# Altium schematic sheet thermistor.SchDoc: thermistor
size A4; Organization: Badgerloop Electrical; Address1: 133 Engineering Research Building; Address2: 1500 Engineering Drive; Address3: Madison, Wi 53706
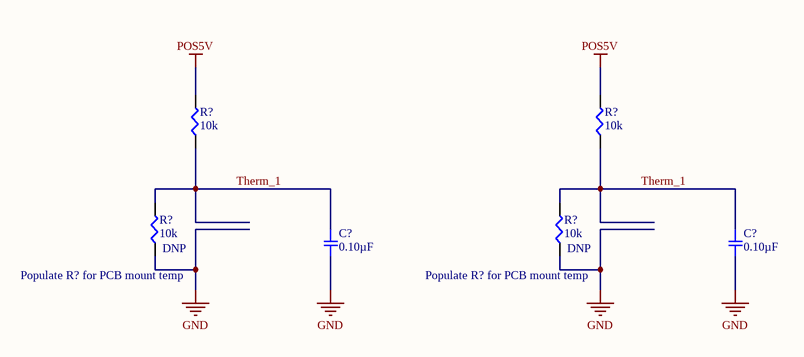
[diagram p0: thermistor.SchDoc]

## Parts
(Parts that share a designator on the sheet are numbered #1, #2 ... from top to bottom, then left to right.)
C?#1  0.10µF  [SMD-0805C]
C?#2  0.10µF  [SMD-0805C]
R?#1  10k  [SMD-0805-RES]
R?#2  10k  [SMD-0805-RES]
R?#3  10k  [SMD-0805-RES]
R?#4  10k  [SMD-0805-RES]

## Nets
GND: C?#1.2 C?#2.2 R?#3.1 R?#4.1
POS5V: R?#1.2 R?#2.2
Therm_1: C?#1.1 C?#2.1 R?#1.1 R?#2.1 R?#3.2 R?#4.2

## Notes on the sheet
- (near R?#3) Populate R? for PCB mount temp
- (near R?#4) Populate R? for PCB mount temp
- Title
- Engineer:
- Date:
- Time:
- Revision:
- Sheet
- of
- File:

## Library data of the parts
C?#1 C?#2 = GRM219R71C104KA01D: CAP CER 0.1UF 16V X7R 0805; Manufacturer: Murata Electronics North America; Factory Stock: 0; Unit Price (USD): 0.13; Minimum Quantity: 1; Tolerance: ±10%; Datasheets: http://www.murata.com/~/media/webrenewal/support/library/catalog/products/capacitor/mlcc/c02e.pdf; Image: //media.digikey.com/Renders/Murata%20Renders/0805%20(2012%20Metric)%20.85mm.jpg; Digi-Key Part Number: 490-1683-1-ND; Part Number: GRM219R71C104KA01D; Quantity Available: 265464; @ qty: 0; Packaging: Cut Tape (CT); Series: GRM; Part Status: Active; Value: 0.10µF; Voltage: 16V; Temperature Coefficient: X7R; Operating Temperature: -55°C ~ 125°C; Features: -; Ratings: -; Applications: General Purpose; Mounting Type: Surface Mount, MLCC; Package / Case: 0805 (2012 Metric); Size / Dimension: 0.079" L x 0.049" W (2.00mm x 1.25mm); Height - Seated (Max): -; Thickness (Max): 0.037" (0.95mm); Lead Spacing: -; Lead Style: -
R?#1-R?#4 = ERJ-P06F1002V: RES SMD 10K OHM 1% 1/2W 0805; Manufacturer: Panasonic Electronic Components; Factory Stock: 0; Unit Price (USD): 0.02534; @ qty: 1500; Minimum Quantity: 1; Power (Watts): 0.5W, 1/2W; Temperature Coefficient: ±100ppm/°C; Part Number: ERJ-P06F1002V; Datasheets: https://industrial.panasonic.com/cdbs/www-data/pdf/RDA0000/AOA0000C243.pdf; Image: //media.digikey.com/Renders/Panasonic%20Renders/ERJ-0805%20Pkg.jpg; Digi-Key Part Number: P16059CT-ND; Quantity Available: 42054; Packaging: Cut Tape (CT); Series: ERJ; Part Status: Active; Value: 10k; Tolerance: ±1%; Composition: Thick Film; Features: Automotive AEC-Q200, Pulse Withstanding; Operating Temperature: -55°C ~ 155°C; Package / Case: 0805 (2012 Metric); Supplier Device Package: 0805; Size / Dimension: 0.079" L x 0.049" W (2.00mm x 1.25mm); Height - Seated (Max): 0.028" (0.70mm); Number of Terminations: 2; Failure Rate: -
  R?#3 R?#4: DNP: DNP